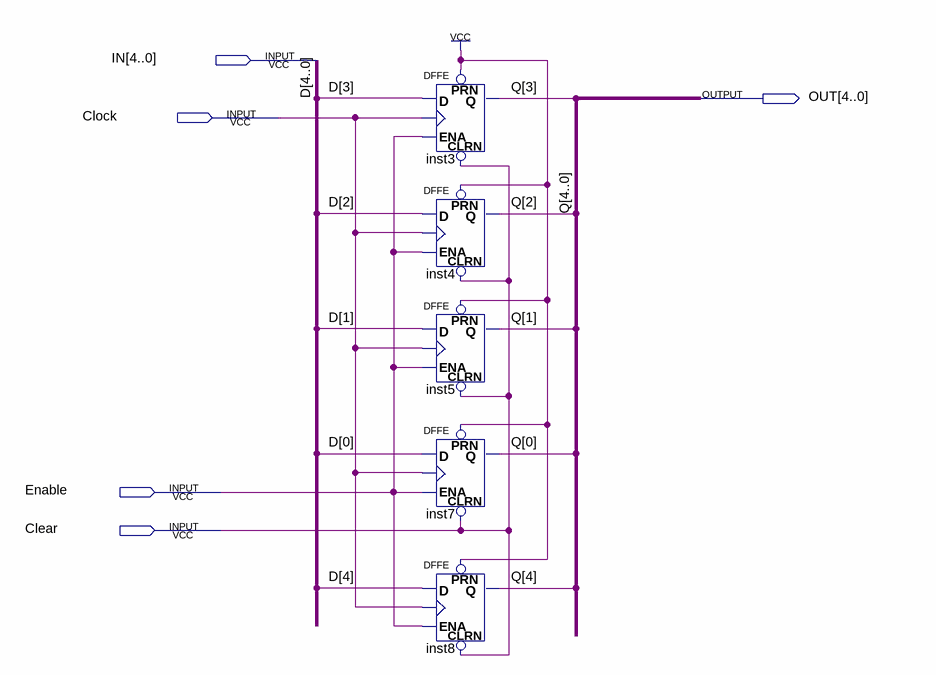
[diagram p0: schematic sheet]
// Quartus schematic ADDR.bdf as structural Verilog: 5 symbols, 5 pins
module ADDR (
  input  [4:0] IN,
  input  Clock,
  input  Enable,
  input  Clear,
  output [4:0] OUT
);

  DFFE inst3 (.PRN(1'b1), .CLRN(Clear), .D(IN[3]), .CLK(Clock), .ENA(Enable), .Q(OUT[3]));
  DFFE inst4 (.PRN(1'b1), .CLRN(Clear), .D(IN[2]), .CLK(Clock), .ENA(Enable), .Q(OUT[2]));
  DFFE inst5 (.PRN(1'b1), .CLRN(Clear), .D(IN[1]), .CLK(Clock), .ENA(Enable), .Q(OUT[1]));
  DFFE inst7 (.PRN(1'b1), .CLRN(Clear), .D(IN[0]), .CLK(Clock), .ENA(Enable), .Q(OUT[0]));
  DFFE inst8 (.PRN(1'b1), .CLRN(Clear), .D(IN[4]), .CLK(Clock), .ENA(Enable), .Q(OUT[4]));

  // Other names for the same wires on the sheet: D[4:0] = IN; Q[4:0] = OUT
endmodule
